# Altium project SoundCollector.PrjPcb
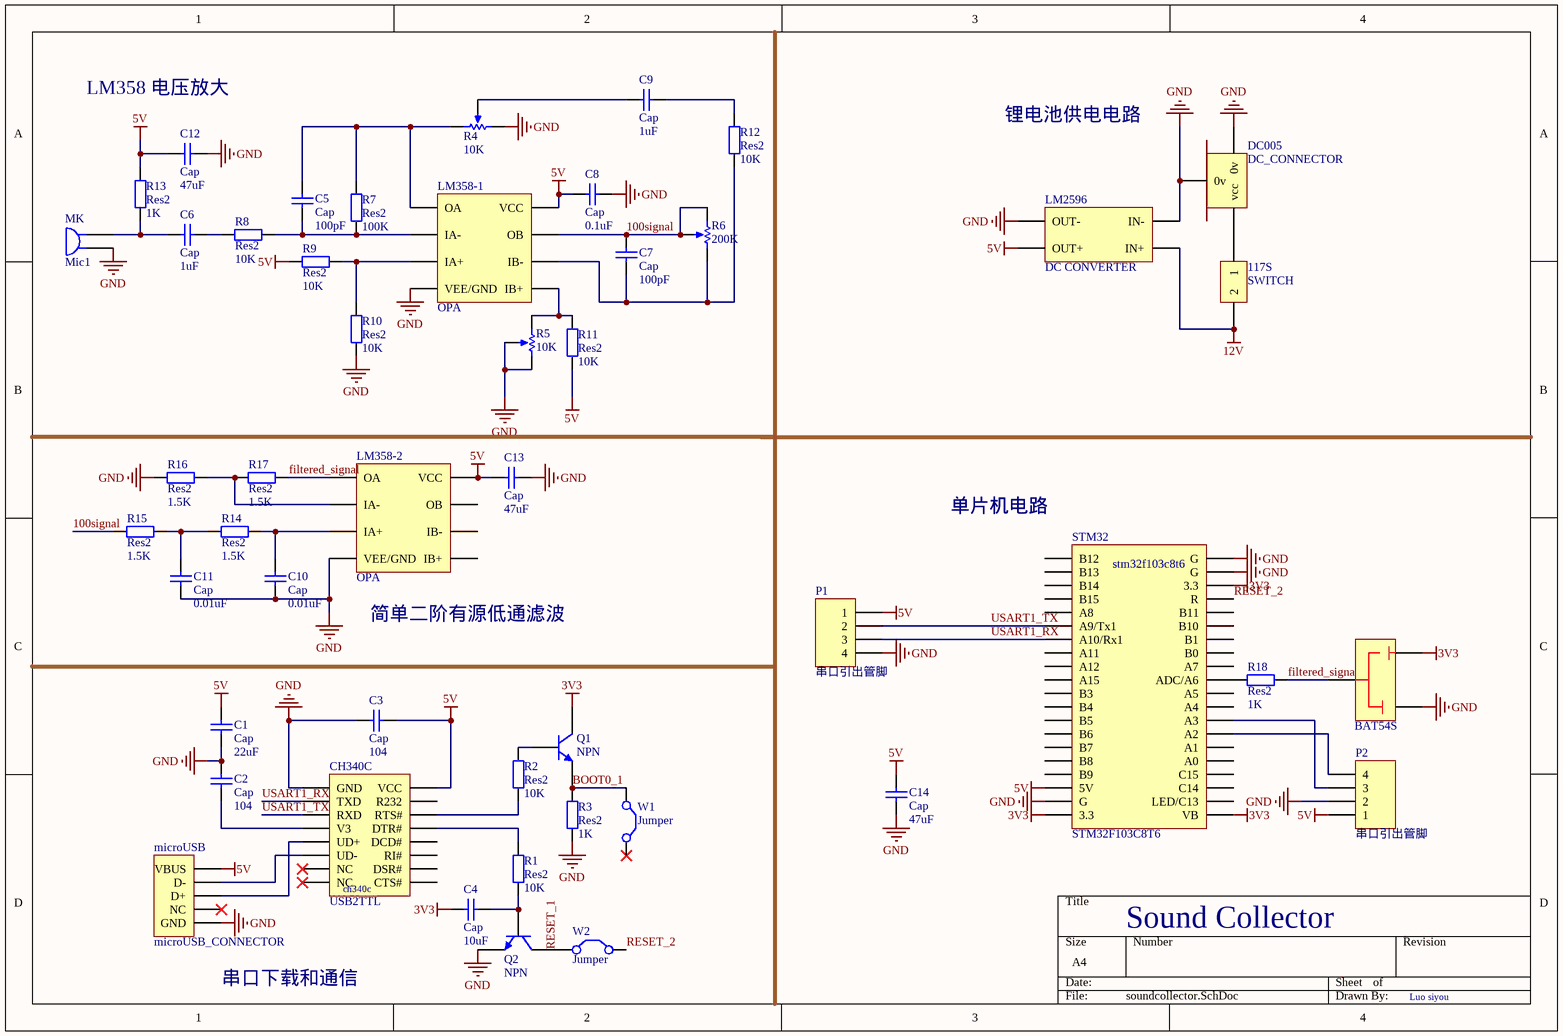
[diagram p0: soundcollector.SchDoc]
1 sheet, 48 parts. Net scope: global (net labels, ports and power ports of the same name join across sheets).
Board file: soundcollector.PcbDoc

## Sheet soundcollector.SchDoc: Sound Collector
size A4; Author: Luo Siyou; DrawnBy: Luo siyou; ProjectName: Sound Collector

### Parts
117S  SWITCH  [117S]
BAT54S  BAT54S  [SOT-23]  (value not drawn)
C1  Cap  value 22uF  [0805]
C2  Cap  value 104  [0805]
C3  Cap  value 104  [0805]
C4  Cap  value 10uF  [0805]
C5  Cap  value 100pF  [0805]
C6  Cap  value 1uF  [0805]
C7  Cap  value 100pF  [0805]
C8  Cap  value 0.1uF  [0805]
C9  Cap  value 1uF  [0805]
C10  Cap  value 0.01uF  [0805]
C11  Cap  value 0.01uF  [0805]
C12  Cap  value 47uF  [0805]
C13  Cap  value 47uF  [0805]
C14  Cap  value 47uF  [0805]
CH340C  USB2TTL  [SOP16]
DC005  DC_CONNECTOR  [DC005]
LM358-1  OPA  [SOP-8]
LM358-2  OPA  [SOP-8]
LM2596  DC CONVERTER  [LM2596S]
microUSB  microUSB_CONNECTOR  [MicroUSB-SIP-5]
MK  Mic1  [PIN2]
P1  串口引出管脚  [HDR1X4]
P2  串口引出管脚  [HDR1X4]
Q1  NPN  [SOT-23]
Q2  NPN  [SOT-23]
R1  Res2  value 10K  [0805]
R2  Res2  value 10K  [0805]
R3  Res2  value 1K  [0805]
R4  10K  [3296W]
R5  10K  [3296W]
R6  200K  [3296W]
R7  Res2  value 100K  [0805]
R8  Res2  value 10K  [0805]
R9  Res2  value 10K  [0805]
R10  Res2  value 10K  [0805]
R11  Res2  value 10K  [0805]
R12  Res2  value 10K  [0805]
R13  Res2  value 1K  [0805]
R14  Res2  value 1.5K  [0805]
R15  Res2  value 1.5K  [0805]
R16  Res2  value 1.5K  [0805]
R17  Res2  value 1.5K  [0805]
R18  Res2  value 1K  [0805]
STM32  STM32F103C8T6  [MCU]
W1  Jumper  [HDR1X2]
W2  Jumper  [HDR1X2]

### Nets
3V3: BAT54S.2(VCC) C4.1 Q1.3(C) STM32.20(3.3) STM32.21(VB) STM32.38(3.3)
5V: C1.2 C3.2 C8.1 C12.1 C13.1 C14.2 CH340C.16(VCC) LM358-1.8(VCC) LM358-2.8(VCC) LM2596.3(OUT+) microUSB.1(VBUS) P1.1 P2.1 R9.1 R11.1 R13.2 STM32.18(5V)
12V: 117S.2 LM2596.2(IN+)
GND: BAT54S.1(GND) C1.1 C2.2 C3.1 C8.2 C10.1 C11.1 C12.2 C13.2 C14.1 CH340C.1(GND) DC005.1(0v) DC005.2(0v) LM358-1.4(VEE/GND) LM358-2.4(VEE/GND) LM2596.1(IN-) LM2596.4(OUT-) microUSB.5(GND) MK.1 P1.4 P2.2 Q2.2(E) R3.1 R4.1(TOP) R5.2(TAP) R5.3(BOT) R10.1 R16.1 STM32.19(G) STM32.39(G) STM32.40(G)
100signal: C7.2 LM358-1.7(OB) R6.1(TOP) R6.2(TAP) R15.1
BOOT0_1: Q1.2(E) R3.2 W1.1(C1)
filtered_signal: BAT54S.3(series) LM358-2.1(OA) R17.1 R18.2
RESET_1: Q2.3(C) W2.1(C1)
RESET_2: STM32.37(R) W2.2(C2)
USART1_RX: CH340C.2(TXD) P1.3 STM32.7(A10/Rx1)
USART1_TX: CH340C.3(RXD) P1.2 STM32.6(A9/Tx1)
Net117S_1: 117S.1 DC005.3(vcc)
NetC2_1: C2.1 CH340C.4(V3)
NetC4_2: C4.2 Q2.1(B) R1.1
NetC5_1: C5.1 LM358-1.2(IA-) R7.1 R8.2
NetC5_2: C5.2 LM358-1.1(OA) R4.3(BOT) R7.2
NetC6_1: C6.1 MK.2 R13.1
NetC6_2: C6.2 R8.1
NetC7_1: C7.1 LM358-1.6(IB-) R6.3(BOT) R12.1
NetC9_1: C9.1 R4.2(TAP)
NetC9_2: C9.2 R12.2
NetC10_2: C10.2 LM358-2.3(IA+) R14.1
NetC11_2: C11.2 R14.2 R15.2
NetCH340C_5: CH340C.5(UD+) microUSB.3(D+)
NetCH340C_6: CH340C.6(UD-) microUSB.2(D-)
NetCH340C_13: CH340C.13(DTR#) R1.2
NetCH340C_14: CH340C.14(RTS#) R2.1
NetLM358-1_3: LM358-1.3(IA+) R9.2 R10.2
NetLM358-1_5: LM358-1.5(IB+) R5.1(TOP) R11.2
NetLM358-2_2: LM358-2.2(IA-) R16.2 R17.2
NetP2_3: P2.3 STM32.28(A3)
NetP2_4: P2.4 STM32.27(A2)
NetQ1_1: Q1.1(B) R2.2
NetR18_1: R18.1 STM32.31(ADC/A6)

Not connected (* = marked no-connect by the designer): CH340C 7(NC)* 8(NC)* 9(CTS#) 10(DSR#) 11(RI#) 12(DCD#) 15(R232); LM358-2 5(IB+) 6(IB-) 7(OB); microUSB 4(NC)*; STM32 1(B12) 2(B13) 3(B14) 4(B15) 5(A8) 8(A11) 9(A12) 10(A15) 11(B3) 12(B4) 13(B5) 14(B6) 15(B7) 16(B8) 17(B9) 22(LED/C13) 23(C14) 24(C15) 25(A0) 26(A1) 29(A4) 30(A5) 32(A7) 33(B0) 34(B1) 35(B10) 36(B11); W1 2(C2)*

### Notes on the sheet
- LM358 电压放大
- 锂电池供电电路
- 单片机电路
- (near LM358-2) 简单二阶有源低通滤波
- (near microUSB) 串口下载和通信
- (in symbol CH340) ch340c
- (in symbol STM32) stm32f103c8t6

### Library data of the parts
117S = 117S: 船形开关
C1-C14 = Cap: Capacitor; Published: 8-Jun-2000; LatestRevisionDate: 17-Jul-2002; LatestRevisionNote: Re-released for DXP Platform.; PackageReference: RAD-0.3; Publisher: Altium Limited
CH340C = CH340: 电平转换芯片
DC005 = DC005: 直流电源插座
LM358-1 LM358-2 = LM358: 集成运放
LM2596 = LM2596: 直流降压模块
microUSB = microUSB: 将microUSB转换成SIP接口
MK = Mic1: Microphone; Published: 24-Mar-1999; LatestRevisionDate: 17-Jul-2002; LatestRevisionNote: Re-released for DXP Platform.; PackageReference: PIN2; Publisher: Altium Limited
P1 P2 = Header 4: Header, 4-Pin; LatestRevisionDate: 17-Jul-2002; LatestRevisionNote: Re-released for DXP Platform.; Publisher: Altium Limited
Q1 Q2 = S8050: NPN三极管
R1-R3 R7-R18 = Res2: Resistor; Published: 8-Jun-2000; LatestRevisionDate: 17-Jul-2002; LatestRevisionNote: Re-released for DXP Platform.; PackageReference: AXIAL-0.4; Publisher: Altium Limited
R4-R6 = RPOT
STM32 = STM32: 单片机最小系统
W1 W2 = Jumper: Jumper Wire; Published: 24-Mar-1999; LatestRevisionDate: 17-Jul-2002; LatestRevisionNote: Re-released for DXP Platform.; PackageReference: RAD-0.2; Publisher: Altium Limited